# Altium schematic sheet Test Points Sheet.SchDoc
size A3
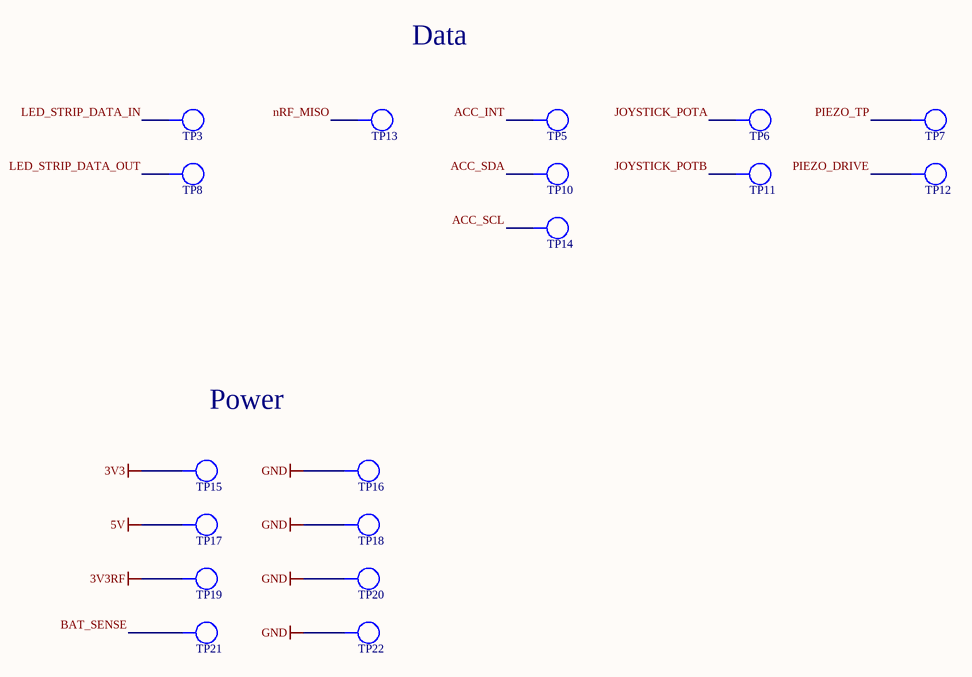
[diagram p0: Test Points Sheet.SchDoc]

## Parts
TP3  TP  [TP_1206]  (value not drawn)  (no BOM)
TP5  TP  [TP_1206]  (value not drawn)  (no BOM)
TP6  TP  [TP_1206]  (value not drawn)  (no BOM)
TP7  TP  [TP_1206]  (value not drawn)  (no BOM)
TP8  TP  [TP_1206]  (value not drawn)  (no BOM)
TP10  TP  [TP_1206]  (value not drawn)  (no BOM)
TP11  TP  [TP_1206]  (value not drawn)  (no BOM)
TP12  TP  [TP_1206]  (value not drawn)  (no BOM)
TP13  TP  [TP_1206]  (value not drawn)  (no BOM)
TP14  TP  [TP_1206]  (value not drawn)  (no BOM)
TP15  TP  [TP_1206]  (value not drawn)  (no BOM)
TP16  TP  [TP_1206]  (value not drawn)  (no BOM)
TP17  TP  [TP_1206]  (value not drawn)  (no BOM)
TP18  TP  [TP_1206]  (value not drawn)  (no BOM)
TP19  TP  [TP_1206]  (value not drawn)  (no BOM)
TP20  TP  [TP_1206]  (value not drawn)  (no BOM)
TP21  TP  [TP_1206]  (value not drawn)  (no BOM)
TP22  TP  [TP_1206]  (value not drawn)  (no BOM)

## Nets
3V3: TP15.1
3V3RF: TP19.1
5V: TP17.1
GND: TP16.1 TP18.1 TP20.1 TP22.1
ACC_INT: TP5.1
ACC_SCL: TP14.1
ACC_SDA: TP10.1
BAT_SENSE: TP21.1
JOYSTICK_POTA: TP6.1
JOYSTICK_POTB: TP11.1
LED_STRIP_DATA_IN: TP3.1
LED_STRIP_DATA_OUT: TP8.1
nRF_MISO: TP13.1
PIEZO_DRIVE: TP12.1
PIEZO_TP: TP7.1

## Notes on the sheet
- Data
- Power
- Title
- Drawn by:
- Date:
- Time:
- Revision:
- Sheet
- of
- File:

## Library data of the parts
TP3 TP5-TP8 TP10-TP22 = TP_1206: Test-Point 3.3x1.6x2.1mm SMD; Manufacturer: Harwin Inc; Manufacturer Part Number: S1751-46R; Manufacturer PN: *; Storage Location: ProtoPlace; Mounting Type: Surface Mount; Type: PC Test Point; Supplier 1: Digi-Key; Supplier Part Number 1: 952-1478-2-ND; Supplier 2: Farnell; Supplier Part Number 2: 1826282; Supplier: ECE Dept; Value: TP